# EAGLE design MicroTeleinfo (EAGLE 7.7.0)
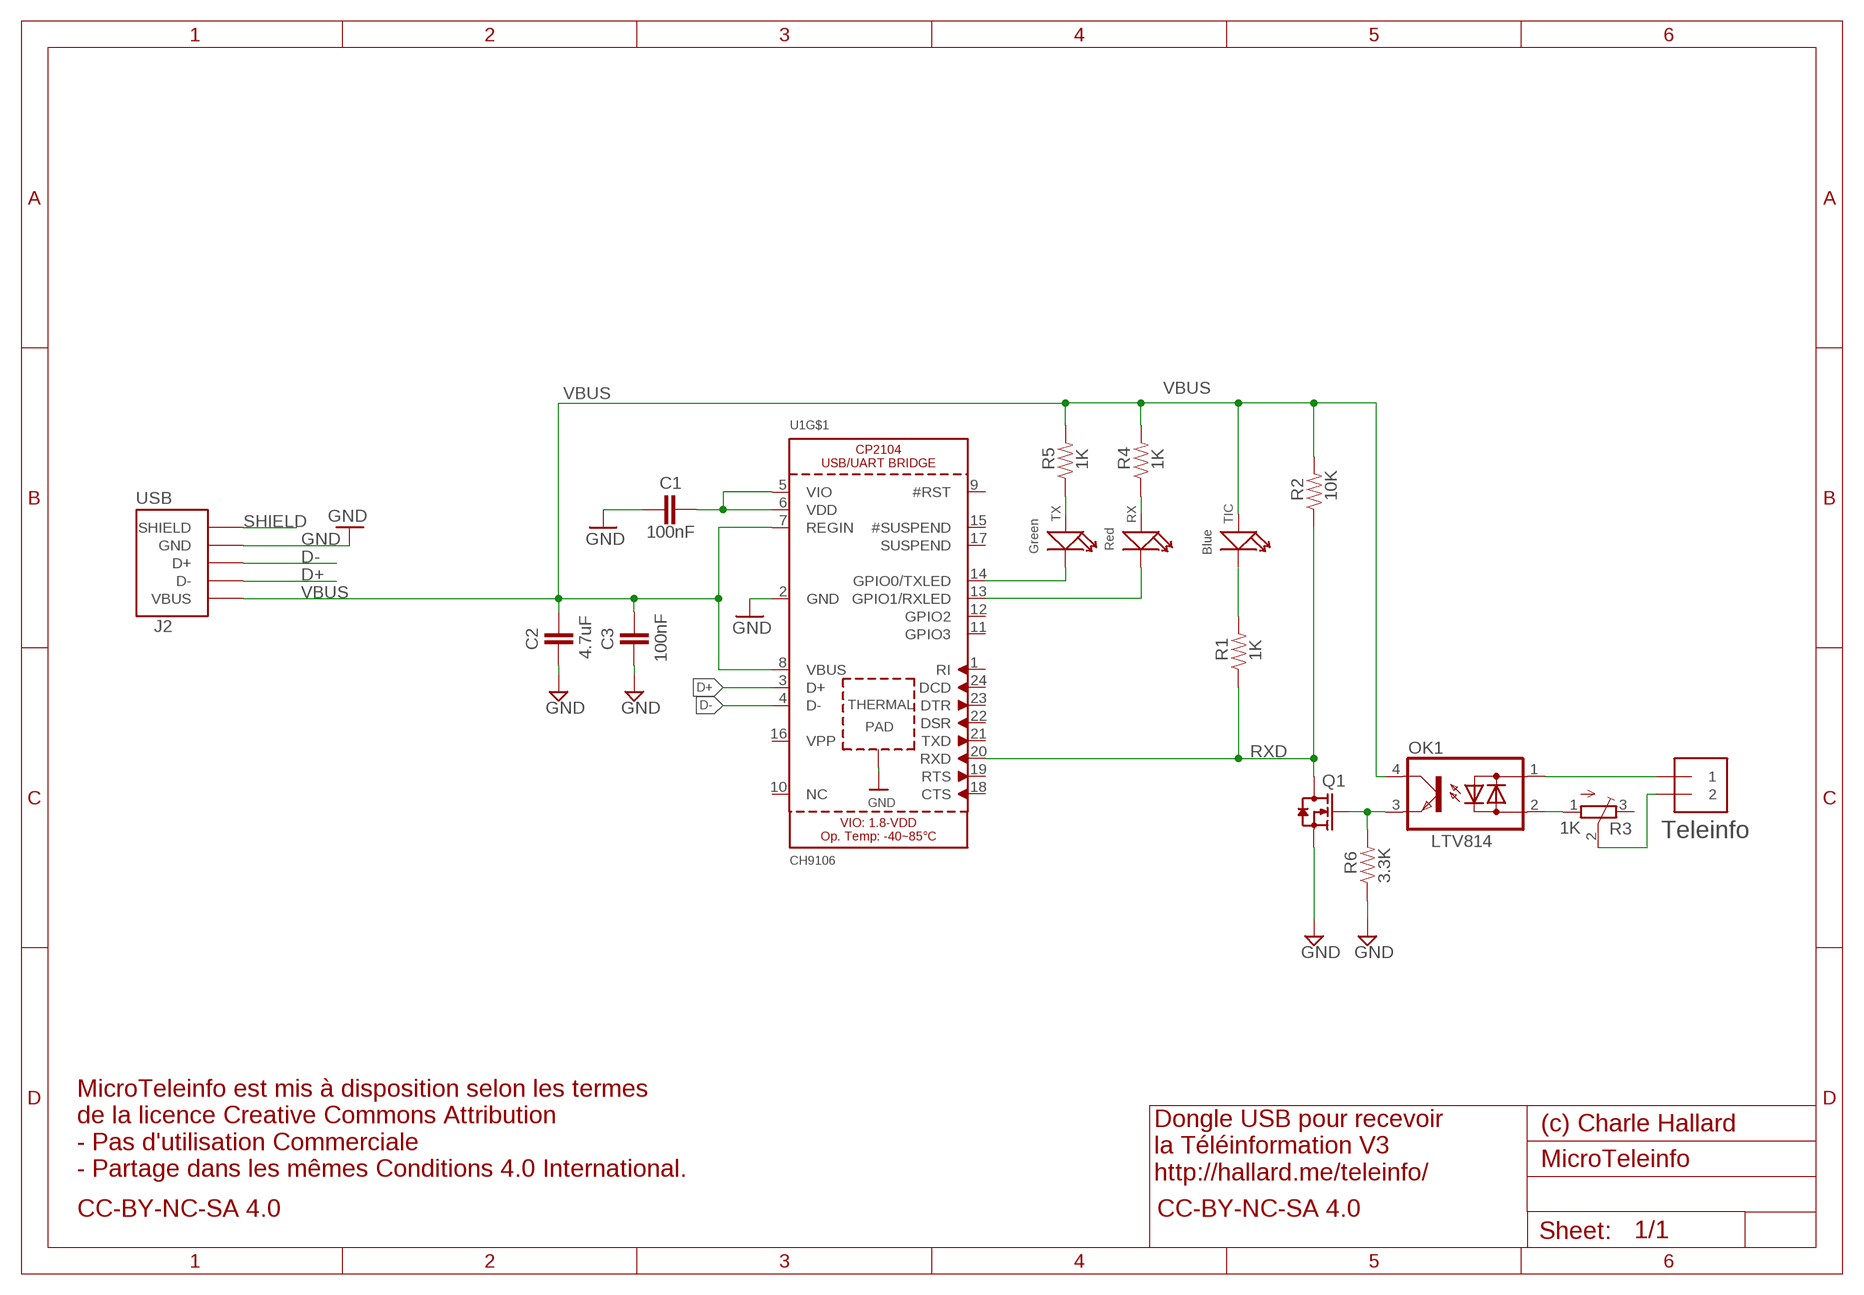
[diagram p0: schematic, sheet 1]

## Parts
C1  100nF  CAP0402-CAP-OK  [0402-CAP-OK]
C2  4.7uF  CAP0402-CAP-OK  [0402-CAP-OK]
C3  100nF  CAP0402-CAP-OK  [0402-CAP-OK]
J1  1X2-3.5MM  [1X2-3.5MM]
J2  USB  USB1061-XX-X-X_REVA  [GCT_USB1061-XX-X-X_REVA]
OK1  LTV814  SFH6206  [DIL4-SMD]
Q1  CJ2302  SMD-MOSFET-N-CH-20V-2.1A-CJ2302(SOT-23)  [SOT-323-3]
R1  1K  RESISTOR0402-RES  [0402-RES]
R2  10K  RESISTOR0402-RES  [0402-RES]
R3  1K  TRIMPOTTC33X  [TC33X]
R4  1K  RESISTOR0402-RES  [0402-RES]
R5  1K  RESISTOR0402-RES  [0402-RES]
R6  3.3K  RESISTOR0402-RES  [0402-RES]
RX  Red  SMD-LED-CLEAR-BLUE(0402)  [LED-0402]
TIC  Blue  SMD-LED-CLEAR-BLUE(0402)  [LED-0402]
TX  Green  SMD-LED-CLEAR-BLUE(0402)  [LED-0402]
U1  CH9106  CP2104  [QFN24_4MM_SMSC]

## Nets
D+: J2.3(D+) U1.3(D+)
D-: J2.2(D-) U1.4(D-)
GND: C1.1 C2.2 C3.1 J2.4(GND) Q1.2(S) R6.1 U1.2(GND) U1.THERM(TP)
N$1 [power]: OK1.3(E) Q1.1(G) R6.2
N$2: C1.2 U1.5(VIO) U1.6(VDD)
N$3: OK1.2(AC2) R3.1(A)
N$4: J1.1 OK1.1(AC1)
N$5: J1.2 R3.2(S)
N$6: R4.1 RX.+
N$7: R5.1 TX.+
N$8: R1.2 TIC.-
N$10: TX.- U1.14(GPIO0/TXLED)
N$12: RX.- U1.13(GPIO1/RXLED)
RXD: Q1.3(D) R1.1 R2.1 U1.20(RXD)
SHIELD: J2.5(SHIELD) J2.6(SHIELD)
VBUS: C2.1 C3.2 J2.1(VBUS) OK1.4(C) R2.2 R4.2 R5.2 TIC.+ U1.7(REGIN) U1.8(VBUS)
Unconnected: R3.3(E) U1.1(RI) U1.9(#RST) U1.10(NC) U1.11(GPIO3) U1.12(GPIO2) U1.15(#SUSPEND) U1.16(VPP) U1.17(SUSPEND) U1.18(CTS) U1.19(RTS) U1.21(TXD) U1.22(DSR) U1.23(DTR) U1.24(DCD)

## Notes on the sheet
- Teleinfo
- (c) Charle Hallard
- MicroTeleinfo est mis à disposition selon les termes
  de la licence Creative Commons Attribution
  - Pas d'utilisation Commerciale 
  - Partage dans les mêmes Conditions 4.0 International.
- Dongle USB pour recevoir
  la Téléinformation V3
  http://hallard.me/teleinfo/
- CC-BY-NC-SA 4.0 | CC-BY-NC-SA 4.0

## Library data of the parts
C1-C3 = _c2h:CAP: Capacitor Standard 0603 ceramic capacitor, and 0.1" leaded capacitor.
J1 = _c2h:1X2: 3.5mm Terminal block http://www.ladyada.net/library/pcb/eaglelibrary.html
J2 = _c2h:USB1061-XX-X-X_REVA: USB Plug, Type A, 4 Pin, Mid Miunt, Offset 1.43mm, SMT, Horizontal, Top Mount, Plastic Peg & Kinked Shelll Stakes Check availability <https://pricing.snapeda.com/parts/USB1061-GF-L-A/Global%20Connector%20Technology/view-part?ref=eda>; AVAILABILITY: In Stock; DESCRIPTION: USB-A (USB TYPE-A) USB 2.0 Plug Connector 4 Position Board Edge, Cutout; Surface Mount; Through Hole, Right Angle; MF: Global Connector Technology; MP: USB1061-GF-L-A; PACKAGE: None; PRICE: None; PURCHASE-URL: https://pricing.snapeda.com/search/part/USB1061-GF-L-A/?ref=eda
OK1 = optocoupler:SFH620: Optocoupler, Phototransistor Output, AC Input Source: http://www.vishay.com/docs/83675/sfh620.pdf; MF: VISHAY/TELEFUNKEN; MPN: SFH6206-3; OC_FARNELL: 1469585; OC_NEWARK: 58K2214
Q1 = _c2h:SMD-MOSFET-N-CH-20V-2.1A-CJ2302(SOT-23): 305030015
R1 R2 R4-R6 = LowPowerLab:RESISTOR: Resistor Basic schematic elements and footprints for 0603, 1206, and PTH resistors.
R3 = adafruit:TRIMPOT: SMT trimmer potentiometer part number TC33X http://www.ladyada.net/library/eagle
RX TIC TX = OPL_Optoelectronics:SMD-LED-CLEAR-BLUE(0402): 304090075; MPN: BL-HB337A-AV-TRB; VALUE: BLUE-0402
U1 = microbuilder:CP2104: CP2104 - USB to UART Bridge VDD Output: 3.45V

## Net classes
1 power: width 0.305 mm

## Board
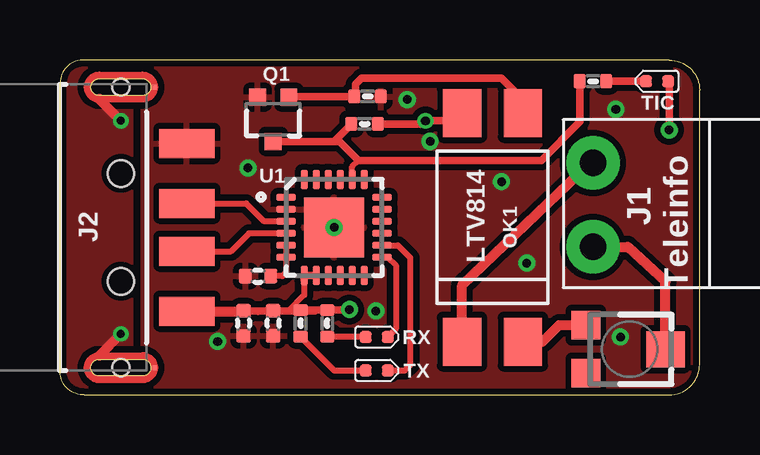
[diagram p1: board, top side]
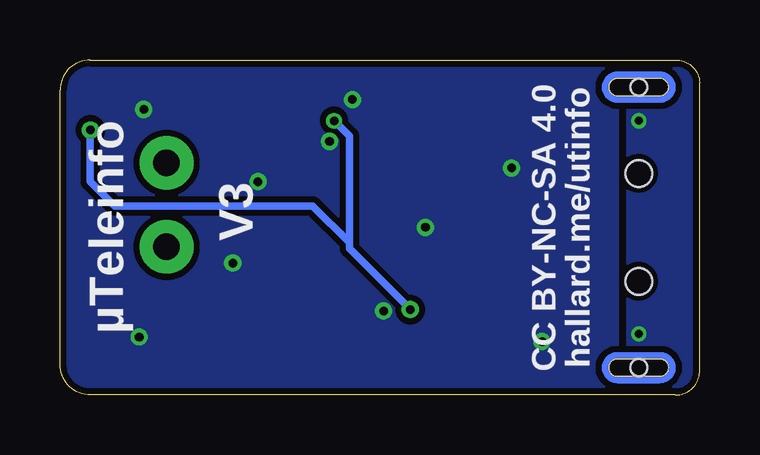
[diagram p2: board, bottom side, seen from below]

Size 26.67 x 13.97 mm. Coordinates in mm from the lower left corner, seen from the top.
Outline: 1.02,0 25.4,0 arc90 26.67,1.27 26.67,12.7 arc90 25.4,13.97 1.02,13.97 arc90 0,13.02 0,0.95 arc90 1.02,0
Copper layers (1*16): Top 0.035mm / dielectric 1.5mm / Bottom 0.035mm
Design rules "SeeedStudio_2layer_DRU_no_angle_20140221 *": minimum track width 6mil, minimum drill 12mil, track to track 6mil, track to pad 6mil, pad to pad 6mil, via to via 6mil, smd to smd 0mil, copper to edge 10mil, drill to drill 10mil, minimum pad ring 10mil, minimum via ring 6mil, stop-mask expansion 2mil, vias tented up to drill 30mil, thermal gap 10mil

### Footprints (pad centres in the part's own frame; a part is rotated, then mirrored left to right if it is on the bottom)
0402-CAP-OK = smd 0.56 x 0.6: 1 -0.521,0; 2 0.525,0
1X2-3.5MM = drill 1.1 pad 2.235: 1 1.8,0; 2 -1.7,0
GCT_USB1061-XX-X-X_REVA = smd 1.2 x 2.3: 1 3.5,2.75; 2 1,2.75; 3 -1,2.75; 4 -3.5,2.75 | smd 0.2 x 0.2: 5 -5.85,1.4; 6 5.85,1.4 | hole 1.1: -2.25,0; 2.25,0 | hole 0.7: -5.85,0; 5.85,0
DIL4-SMD = smd 1.6 x 2: 1 -1.27,-4.77; 2 1.27,-4.77; 3 1.27,4.77; 4 -1.27,4.77
SOT-323-3 = smd 0.7 x 0.7: 1 -0.65,-0.925; 2 0.65,-0.925; 3 0,0.925
0402-RES = smd 0.5 x 0.6: 1 -0.55,0; 2 0.55,0
TC33X = smd 1.2 x 1.2: 1 -1,-1.825; 3 1,-1.825 | smd 1.5 x 1.6: 2 0,1.5
LED-0402 = smd 0.5 x 0.5: + -0.463,0; - 0.463,0
QFN24_4MM_SMSC = smd 0.8 x 0.28: 1 -2,1.25; 2 -2,0.75; 3 -2,0.25; 4 -2,-0.25; 5 -2,-0.75; 6 -2,-1.25; 13 2,-1.25; 14 2,-0.75; 15 2,-0.25; 16 2,0.25; 17 2,0.75; 18 2,1.25 | smd 0.28 x 0.8: 7 -1.25,-2; 8 -0.75,-2; 9 -0.25,-2; 10 0.25,-2; 11 0.75,-2; 12 1.25,-2; 19 1.25,2; 20 0.75,2; 21 0.25,2; 22 -0.25,2; 23 -0.75,2; 24 -1.25,2 | smd 2.5 x 2.5: THERM 0,0

### Placement (x,y rotation side)
C1  8.25,4.95 0 top
C2  7.65,2.98 270 top
C3  8.89,2.98 90 top
J1  22.23,7.87 90 top
J2  2.54,6.98 270 top
OK1  18.03,6.98 0 top
Q1  8.89,11.49 180 top
R1  22.23,13.08 0 top
R2  12.7,11.3 0 top
R3  23.75,1.91 270 top
R4  11.14,2.98 90 top
R5  10.03,2.98 90 top
R6  12.83,12.45 180 top
RX  13.21,2.41 0 top
TIC  24.89,13.08 180 top
TX  13.21,1.02 0 top
U1  11.43,6.98 0 top
U$2  [LOGO_CH2I_015_COPPER]  8,3.81 90 bottom

### Tracks (layer width: path | path; a pad name or v marks a point on that pad's centre or on a via)
D+
  Top 0.254: U1.3 8.51,7.23 7.76,7.98 J2.3
D-
  Top 0.254: U1.4 7.88,6.73 7.13,5.98 J2.2
GND  (via drill 0.36 pad 0.71)
  Top 0.254: 11.43,7.11 U1.THERM
  other vias: 23.18,11.91 23.37,2.41 11.43,6.98 18.41,8.89 19.46,5.49 14.48,12.32 13.18,3.49 6.57,2.22 7.84,9.46 15.43,10.57
  pour Top (isolate 0.254): 3.43,14.16 26.99,14.16 26.99,-0.44 3.43,-0.44
  pour Bottom (isolate 0.254): 3.43,14.29 26.73,14.29 26.73,-0.44 3.43,-0.44
N$1
  Top 0.305: OK1.3 19.05,12.57 18.41,13.21 12.57,13.21 12.32,12.95 12.32,12.49 R6.2 9.57,12.45 Q1.1
N$2
  Top 0.254: C1.2 9.27,4.95 9.43,5.11 U1.6 U1.5
N$3
  Top 0.406: R3.1 20.81,2.91 20.12,2.22 OK1.2
N$4
  Top 0.406: OK1.1 16.76,4.57 22.12,9.67 J1.1
N$5
  Top 0.406: J1.2 23.67,6.17 25.25,4.72 R3.2
N$6
  Top 0.254: RX.+ 11.17,2.41 R4.1
N$7
  Top 0.254: R5.1 10,2.4 10.04,2.4 11.43,1.02 TX.+
N$8
  Top 0.305: R1.2 TIC.-
N$10
  Top 0.254: U1.14 14.09,6.23 14.61,5.72 14.61,1.24 14.38,1.02 TX.-
N$12
  Top 0.254: U1.13 13.66,5.73 14,5.4 14,2.74 RX.-
RXD
  Top 0.254: U1.20 12.18,9.51 12.45,9.78
  Top 0.305: R2.1 12.06,11.22 12.06,11.2 11.43,10.57 | Q1.3 11.43,10.57 | 11.43,10.57 11.66,10.57 12.45,9.78 20.07,9.78 21.67,11.39 R1.1
SHIELD  (via drill 0.33)
  Top 0.406: v2.54,11.43 v2.54,11.44 1.64,12.34 | v2.54,2.54 1.64,1.64
  pour Bottom (isolate 0.254): -0.25,14.29 2.98,14.29 2.98,-0.44 -0.25,-0.44
  pour Top (isolate 0.254): -0.25,14.16 2.98,14.16 2.98,-0.44 -0.25,-0.44
VBUS  (via drill 0.36, 0.36 pad 0.71)
  Top 0.254: 10.18,4.8 10.18,4.16 9.52,3.51
  Top 0.305: OK1.4 16.18,11.43 v15.24,11.43 15.11,11.3 R2.2 | v25.4,11.05 25.4,13.04 TIC.+ | 8.27,3.48 C2.1 9.52,3.51 C3.2 10.64,3.51 R5.2 | R5.2 R4.2 12.04,3.54 v12.06,3.56 | 10.68,3.55 R5.2 | 10.18,4.8 U1.7 U1.8
  Top 0.406: J2.1 7.63,3.48 C2.1
  Bottom 0.305: 14.61,6.35 14.61,10.8 v15.24,11.43 | 14.61,6.35 16.13,7.87 24.38,7.87 25.4,8.89 v25.4,11.05 | 14.61,6.35 14.61,6.1 v12.06,3.56

### Text on the board
tPlace: Q1 | OK1
bPlace: hallard.me/utinfo
tNames: Teleinfo
bNames: CC BY-NC-SA 4.0 | V3 | µTeleinfo
tStop: V3 | µTeleinfo